# Altium schematic sheet USB_To_Ethernet.SchDoc
size A0
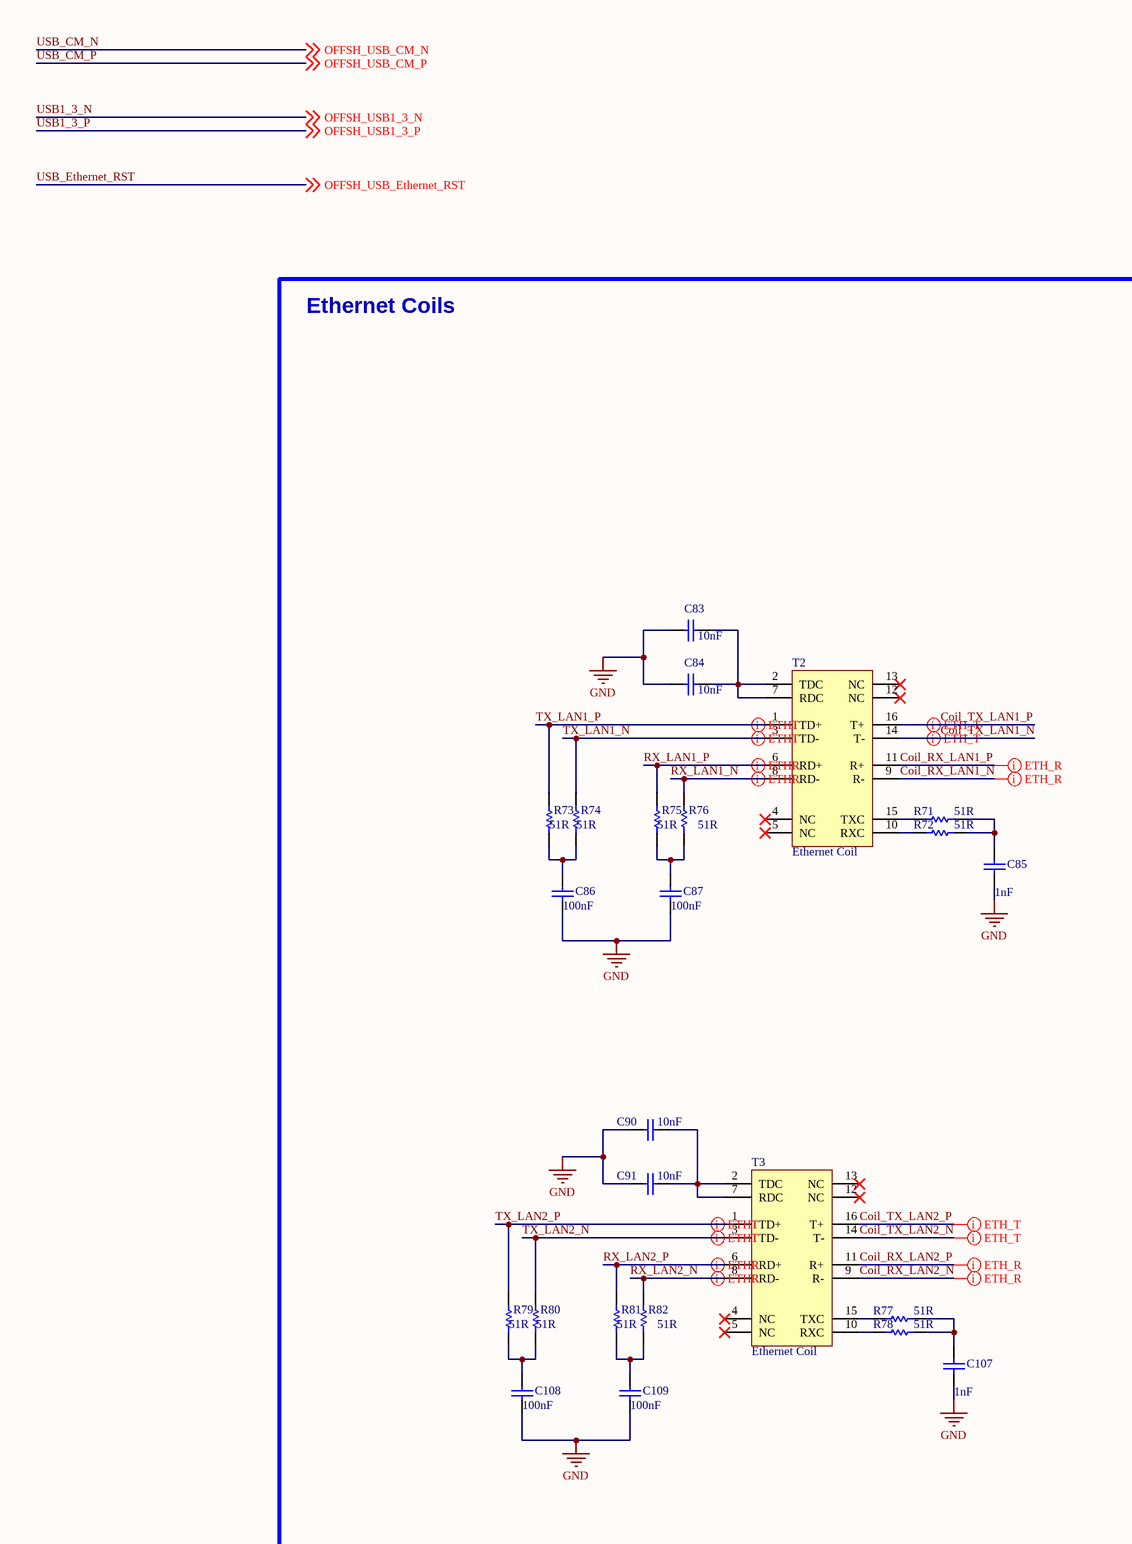
[diagram p0: USB_To_Ethernet.SchDoc, top left]
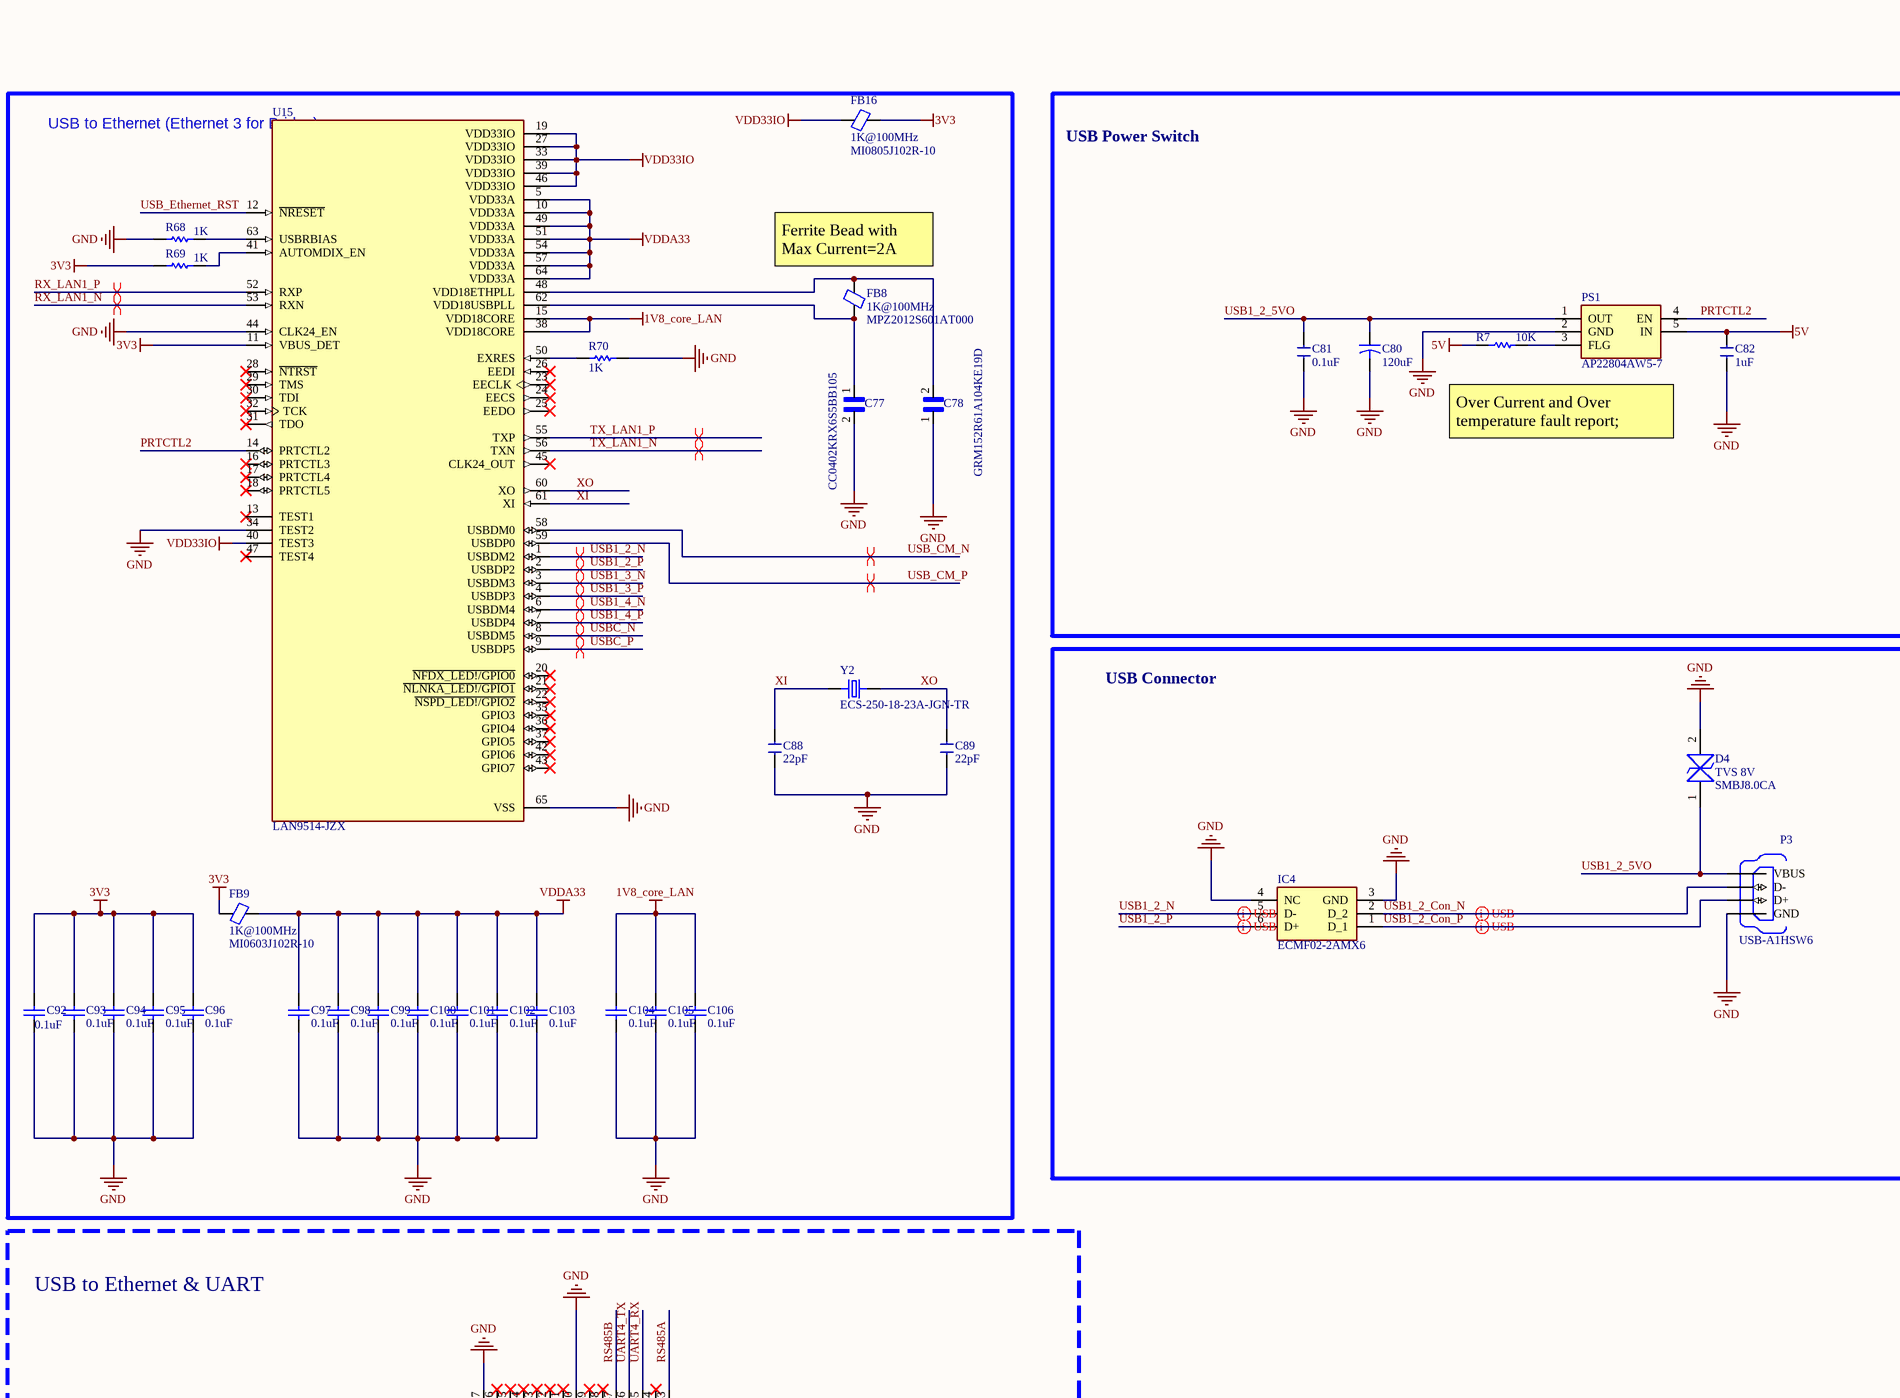
[diagram p1: USB_To_Ethernet.SchDoc, top middle]
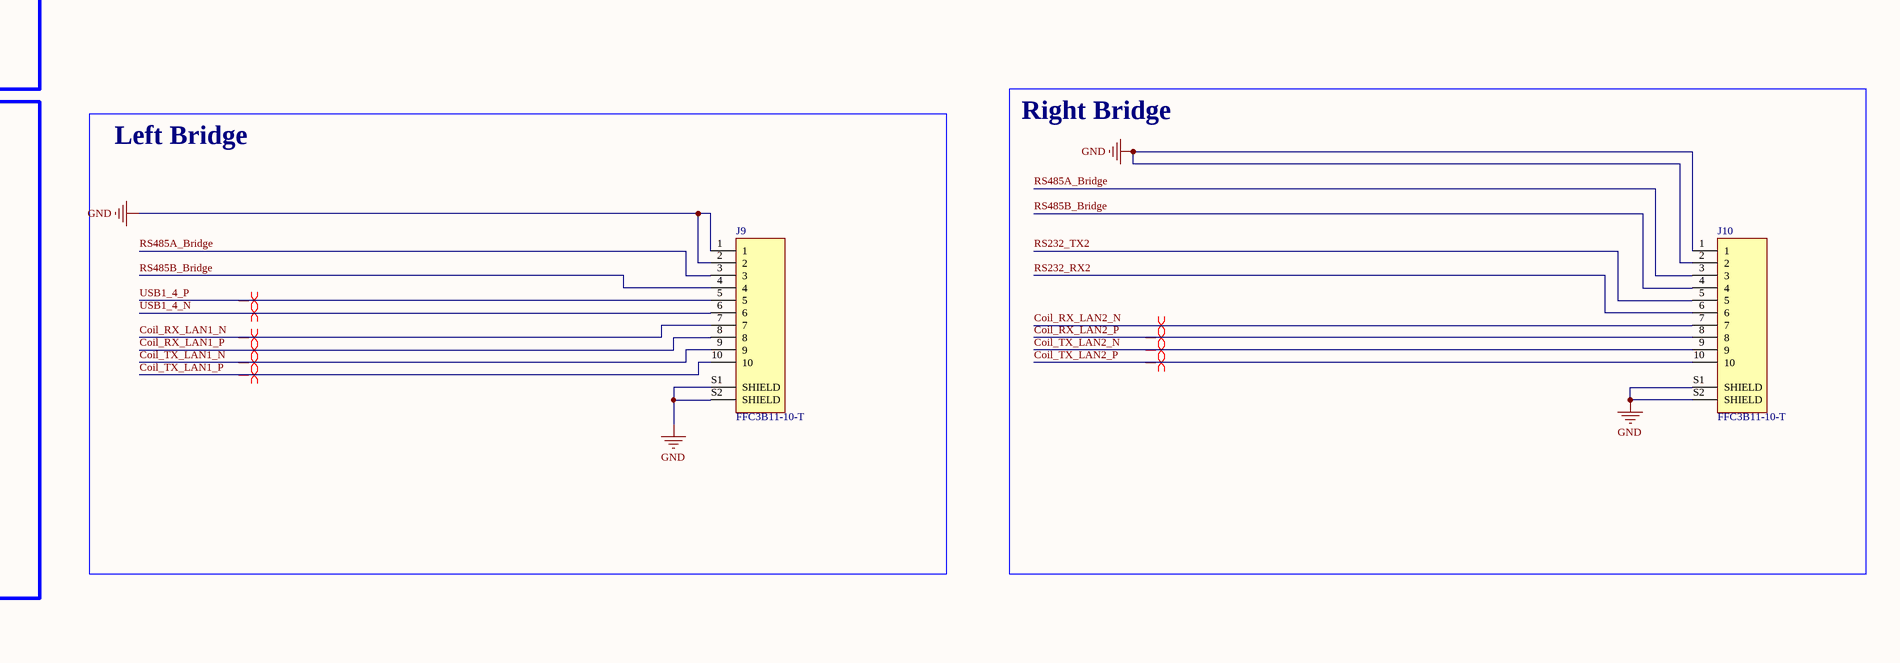
[diagram p2: USB_To_Ethernet.SchDoc, top right]
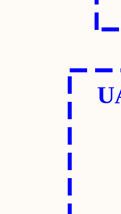
[diagram p3: USB_To_Ethernet.SchDoc, bottom left]
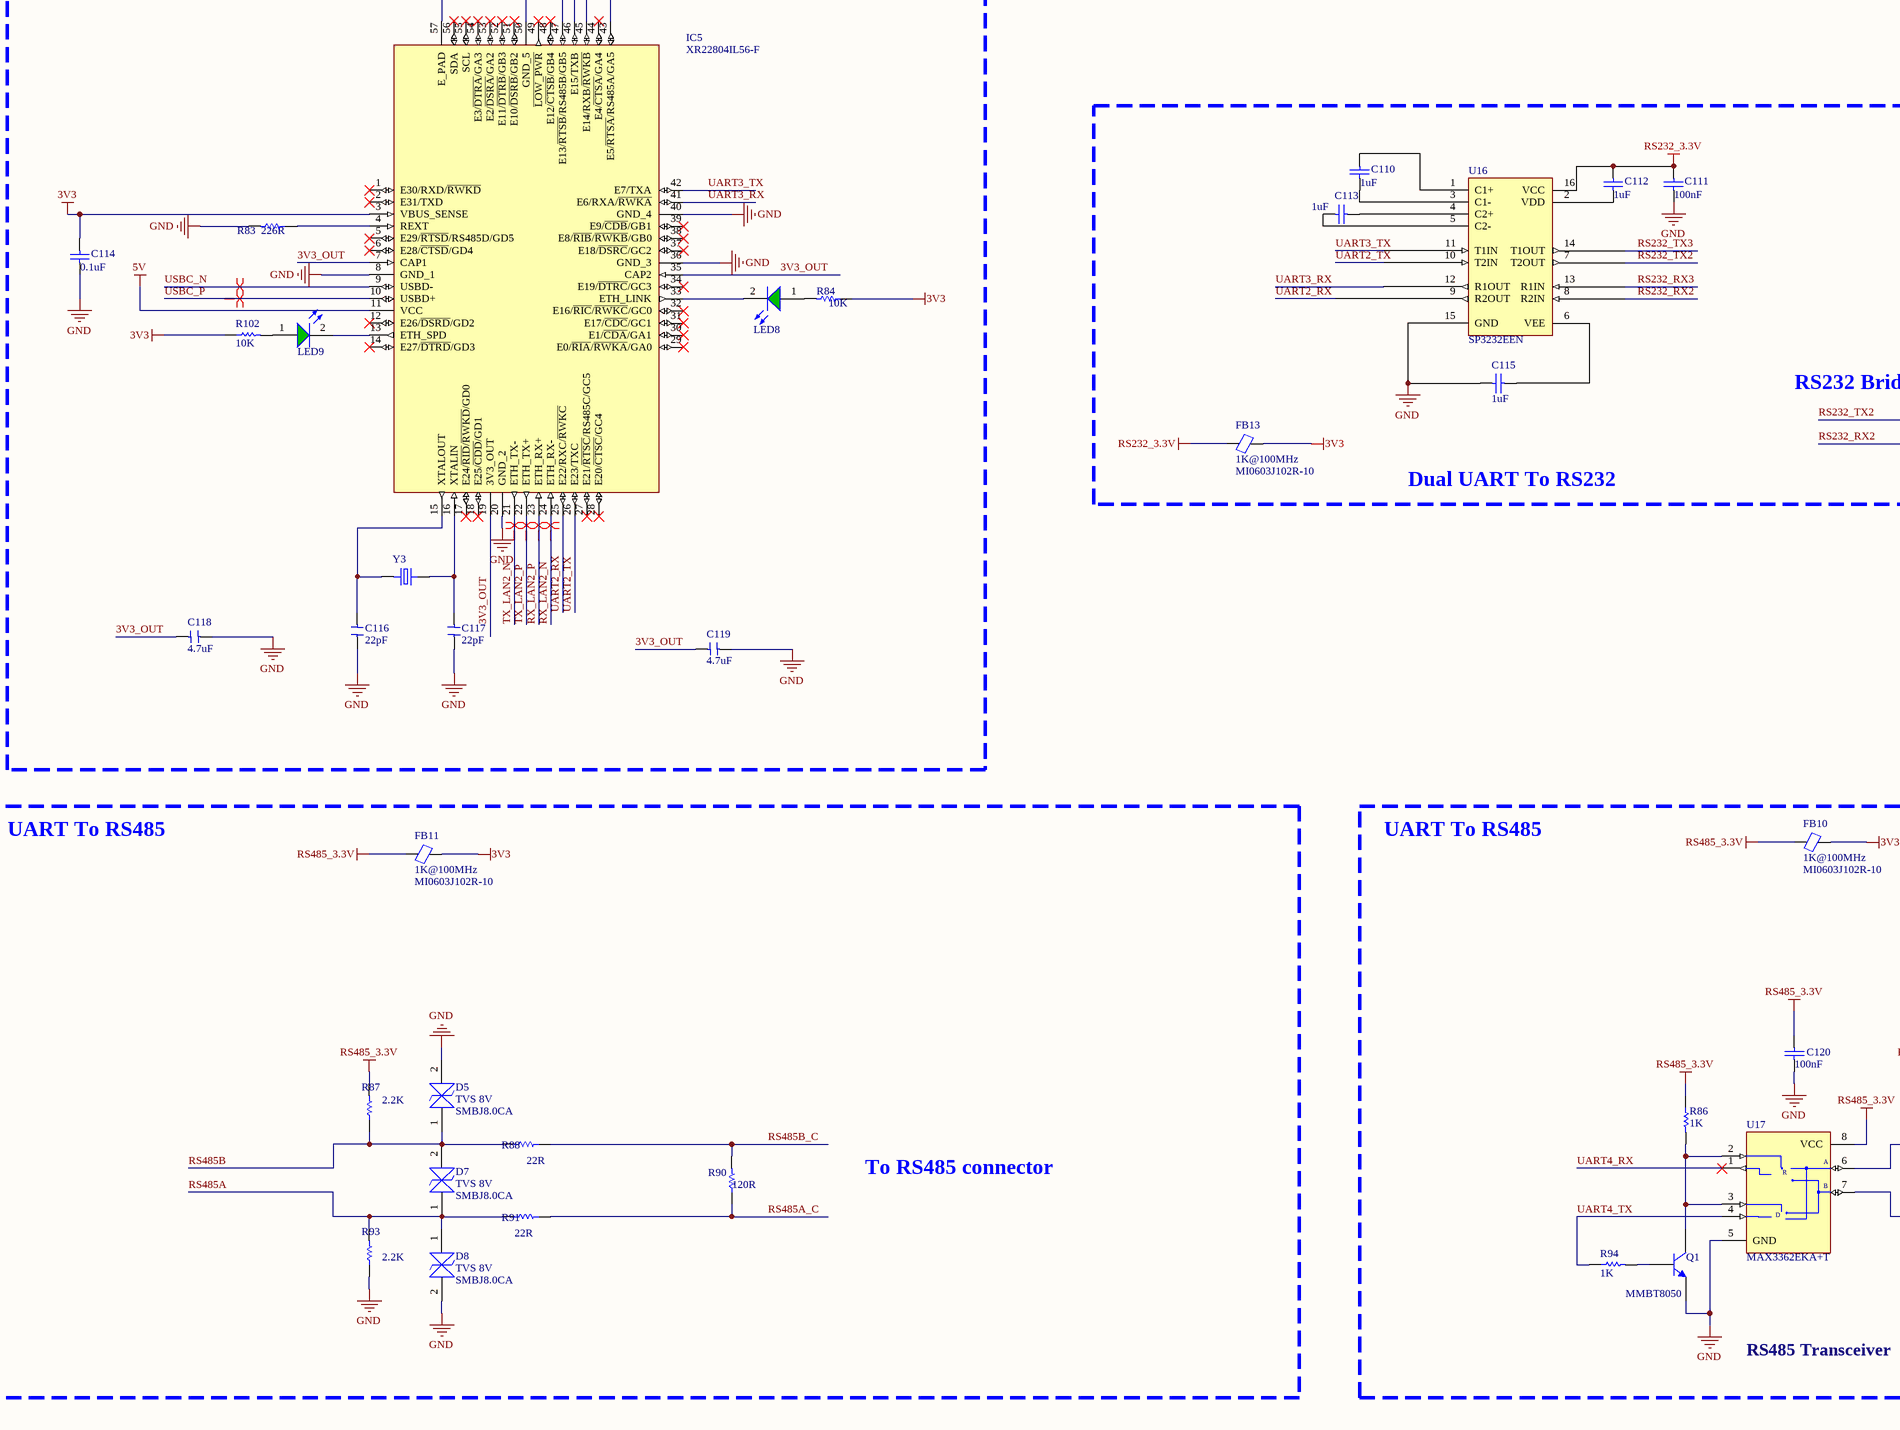
[diagram p4: USB_To_Ethernet.SchDoc, bottom middle]
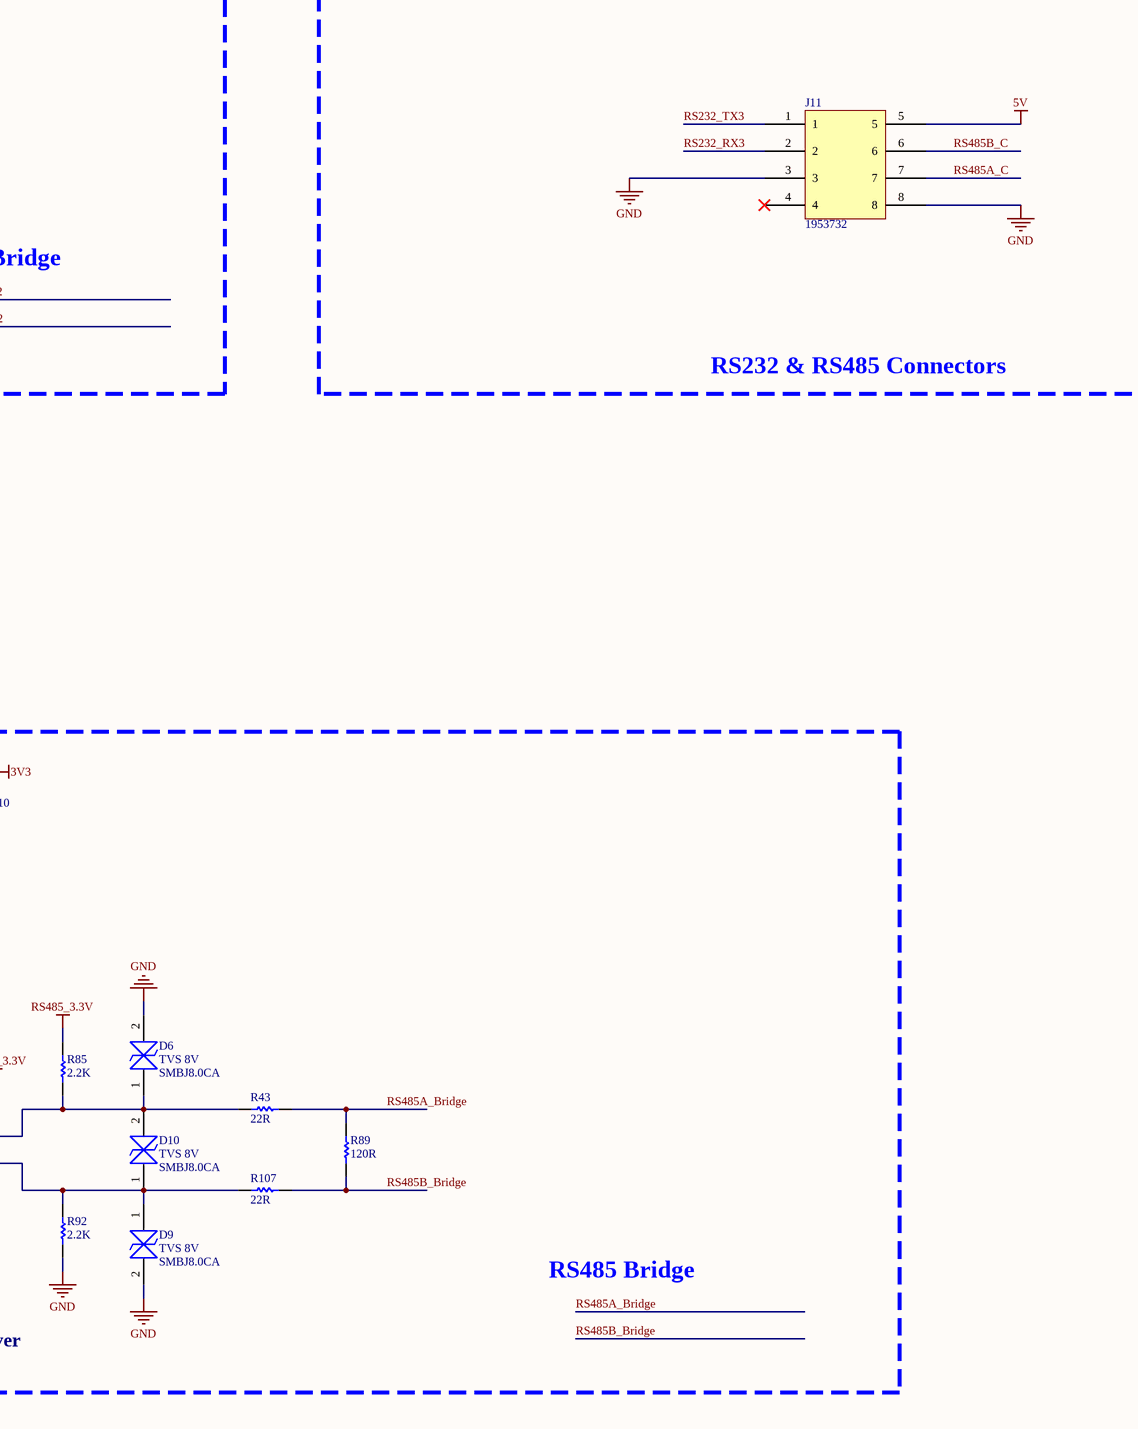
[diagram p5: USB_To_Ethernet.SchDoc, bottom right]

## Parts
C77  CC0402KRX6S5BB105  [CAPC1005X55N]
C78  GRM152R61A104KE19D  [CAPC1005X22N]
C80  value 120uF  [TANTAL (SIZE B)]  (hidden comment: Cap_Tantal)
C81  value 0.1uF  [0603 Capacitor]  (hidden comment: Capacitor SMD)
C82  value 1uF  [0603 Capacitor]  (hidden comment: Capacitor SMD)
C83  10nF  [CAP (0603)]
C84  10nF  [CAP (0603)]
C85  1nF  [CAP (0603)]
C86  100nF  [CAP (0603)]
C87  100nF  [CAP (0603)]
C88  value 22pF  [0603 Capacitor]  (hidden comment: Capacitor SMD)
C89  value 22pF  [0603 Capacitor]  (hidden comment: Capacitor SMD)
C90  10nF  [CAP (0603)]
C91  10nF  [CAP (0603)]
C92  0.1uF  [C0603]
C93  0.1uF  [C0603]
C94  0.1uF  [C0603]
C95  0.1uF  [C0603]
C96  0.1uF  [C0603]
C97  0.1uF  [C0603]
C98  0.1uF  [C0603]
C99  0.1uF  [C0603]
C100  0.1uF  [C0603]
C101  0.1uF  [C0603]
C102  0.1uF  [C0603]
C103  0.1uF  [C0603]
C104  0.1uF  [C0603]
C105  0.1uF  [C0603]
C106  0.1uF  [C0603]
C107  1nF  [CAP (0603)]
C108  100nF  [CAP (0603)]
C109  100nF  [CAP (0603)]
C110  1uF  [C0603]
C111  100nF  [C0603]
C112  1uF  [C0603]
C113  1uF  [C0603]
C114  0.1uF  [C0603]
C115  value 1uF  [C0603]
C116  value 22pF  [0603 Capacitor]  (hidden comment: Capacitor SMD)
C117  value 22pF  [0603 Capacitor]  (hidden comment: Capacitor SMD)
C118  value 4.7uF  [0603 Capacitor]  (hidden comment: Capacitor SMD)
C119  value 4.7uF  [0603 Capacitor]  (hidden comment: Capacitor SMD)
C120  value 100nF  [C1206]  (hidden comment: Cap Semi)
D4  TVS 8V  Part Number: SMBJ8.0CA  [DIOM5436X244N (SMB)]
D5  TVS 8V  Part Number: SMBJ8.0CA  [DIOM5436X244N (SMB)]
D6  TVS 8V  Part Number: SMBJ8.0CA  [DIOM5436X244N (SMB)]
D7  TVS 8V  Part Number: SMBJ8.0CA  [DIOM5436X244N (SMB)]
D8  TVS 8V  Part Number: SMBJ8.0CA  [DIOM5436X244N (SMB)]
D9  TVS 8V  Part Number: SMBJ8.0CA  [DIOM5436X244N (SMB)]
D10  TVS 8V  Part Number: SMBJ8.0CA  [DIOM5436X244N (SMB)]
FB8  value 1K@100MHz  Part Number: MPZ2012S601AT000  [FB0805]  (hidden comment: Ferrite Bead)
FB9  value 1K@100MHz  Part Number: MI0603J102R-10  [FB0603]  (hidden comment: Ferrite Bead)
FB10  value 1K@100MHz  Part Number: MI0603J102R-10  [FB0603]  (hidden comment: Ferrite Bead)
FB11  value 1K@100MHz  Part Number: MI0603J102R-10  [FB0603]  (hidden comment: Ferrite Bead)
FB13  value 1K@100MHz  Part Number: MI0603J102R-10  [FB0603]  (hidden comment: Ferrite Bead)
FB16  value 1K@100MHz  Part Number: MI0805J102R-10  [FB0805]  (hidden comment: Ferrite Bead)
IC4  ECMF02-2AMX6  [SON50P150X170X55-6N-D]
IC5  XR22804IL56-F  [QFN50P800X800X90-57N]
J9  FFC3B11-10-T  [PCBComponent_1]
J10  FFC3B11-10-T  [PCBComponent_1]
J11  1953732  [1953732]
LED8  150080GS75000  [LED_0805_Green]  (value not drawn)
LED9  150080GS75000  [LED_0805_Green]  (value not drawn)
P3  USB-A1HSW6  [OST_USB-A1HSW6]
PS1  AP22804AW5-7  [SOT95P285X140-5N]
Q1  MMBT8050  [SOT95P237X111-3N (SOT23)]
R7  value 10K  [RES (0603)]  (hidden comment: Res)
R43  value 22R  [RES (0603)]  (hidden comment: Res)
R68  value 1K  [R0603]  (hidden comment: Res)
R69  value 1K  [R0603]  (hidden comment: Res)
R70  value 1K  [R0603]  (hidden comment: Res)
R71  51R  [RES 0603]
R72  51R  [RES 0603]
R73  51R  [RES 0603]
R74  51R  [RES 0603]
R75  51R  [RES 0603]
R76  51R  [RES 0603]
R77  51R  [RES 0603]
R78  51R  [RES 0603]
R79  51R  [RES 0603]
R80  51R  [RES 0603]
R81  51R  [RES 0603]
R82  51R  [RES 0603]
R83  value 226R  [R0603]  (hidden comment: Res)
R84  value 10K  [R0603]  (hidden comment: Res)
R85  value 2.2K  [RES (0603)]  (hidden comment: Res)
R86  value 1K  [RES (0603)]  (hidden comment: Res)
R87  value 2.2K  [R0603]  (hidden comment: Res)
R88  value 22R  [R0603]  (hidden comment: Res)
R89  value 120R  [RES (0603)]  (hidden comment: Res)
R90  value 120R  [R0603]  (hidden comment: Res)
R91  value 22R  [R0603]  (hidden comment: Res)
R92  value 2.2K  [RES (0603)]  (hidden comment: Res)
R93  value 2.2K  [R0603]  (hidden comment: Res)
R94  value 1K  [RES (0603)]  (hidden comment: Res)
R102  value 10K  [RES (0603)]  (hidden comment: Res)
R107  value 22R  [RES (0603)]  (hidden comment: Res)
T2  Ethernet Coil  [SOIC127P940X597-16N (SOIC16)]
T3  Ethernet Coil  [SOIC127P940X597-16N (SOIC16)]
U15  LAN9514-JZX  [QFN50P900X900X100-65N730X730]
U16  SP3232EEN  [SOIC16_M]
U17  RS485 Transceiver  [SOT65P280X145-8N (SOT23)]  (value not drawn)
Y2  ECS-250-18-23A-JGN-TR  [XTAL_ECS-250-18-23A-JGN-TR]
Y3  ECS-250-18-23A-JGN-TR  [XTAL_ECS-250-18-23A-JGN-TR]  (value not drawn)

## Blocks framed on the sheet
USB to Ethernet (Ethernet 3 for Bridge): C77 C78 C88 C89 C92-C106 FB8 FB9 FB16 R68-R70 U15 Y2
USB Power Switch: C80-C82 PS1 R7
Ethernet Coils: C83-C87 C90 C91 C107-C109 R71-R82 T2 T3
USB Connector: D4 IC4 P3
Left Bridge: J9
Right Bridge: J10

## Nets
1V8_core_LAN: C104.2 C105.2 C106.2 U15.15(VDD18CORE) U15.38(VDD18CORE)
3V3: C92.2 C93.2 C94.2 C95.2 C96.2 C114.2 FB9.1 FB10.2 FB11.2 FB13.2 FB16.2 IC5.3(VBUS_SENSE) R69.2 R84.1 R102.1 U15.11(VBUS_DET)
5V: C82.1 IC5.11(VCC) J11.5 PS1.5(IN) R7.1
GND: C77.2 C78.1 C80.2 C81.2 C82.2 C83.1 C84.1 C85.1 C86.1 C87.1 C88.2 C89.2 C90.1 C91.1 C92.1 C93.1 C94.1 C95.1 C96.1 C97.1 C98.1 C99.1 C100.1 C101.1 C102.1 C103.1 C104.1 C105.1 C106.1 C107.1 C108.1 C109.1 C111.1 C114.1 C115.2 C116.2 C117.2 C118.2 C119.2 C120.2 D4.2(A) D5.2(A) D6.2(A) D8.2(A) D9.2(A) IC4.3(GND) IC4.4(NC) IC5.8(GND_1) IC5.20(GND_2) IC5.36(GND_3) IC5.40(GND_4) IC5.50(GND_5) IC5.57(E_PAD) J9.1 J9.2 J9.S1(SHIELD) J9.S2(SHIELD) J10.1 J10.2 J10.S1(SHIELD) J10.S2(SHIELD) J11.3 J11.8 P3.4(GND) PS1.2(GND) Q1.2(E) R68.2 R70.1 R83.2 R92.2 R93.1 U15.34(TEST2) U15.44(CLK24_EN) U15.65(VSS) U16.15(GND) U17.5(GND)
RS232_3.3V: C111.2 C112.2 FB13.1 U16.16(VCC)
RS485_3.3V: C120.1 FB10.1 FB11.1 R85.1 R86.1 R87.2 U17.8(VCC)
VDD33IO: FB16.1 U15.19(VDD33IO) U15.27(VDD33IO) U15.33(VDD33IO) U15.39(VDD33IO) U15.40(TEST3) U15.46(VDD33IO)
VDDA33: C97.2 C98.2 C99.2 C100.2 C101.2 C102.2 C103.2 FB9.2 U15.5(VDD33A) U15.10(VDD33A) U15.49(VDD33A) U15.51(VDD33A) U15.54(VDD33A) U15.57(VDD33A) U15.64(VDD33A)
3V3_OUT: C118.1 C119.1 IC5.7(CAP1) IC5.19(3V3_OUT) IC5.35(CAP2)
Coil_RX_LAN1_N: J9.7 T2.9(R-)
Coil_RX_LAN1_P: J9.8 T2.11(R+)
Coil_RX_LAN2_N: J10.7 T3.9(R-)
Coil_RX_LAN2_P: J10.8 T3.11(R+)
Coil_TX_LAN1_N: J9.9 T2.14(T-)
Coil_TX_LAN1_P: J9.10 T2.16(T+)
Coil_TX_LAN2_N: J10.9 T3.14(T-)
Coil_TX_LAN2_P: J10.10 T3.16(T+)
PRTCTL2: PS1.4(EN) U15.14(PRTCTL2)
RS232_RX2: J10.6 U16.8(R2IN)
RS232_RX3: J11.2 U16.13(R1IN)
RS232_TX2: J10.5 U16.7(T2OUT)
RS232_TX3: J11.1 U16.14(T1OUT)
RS485A: D7.1(K) D8.1(K) IC5.43(E5/~{RTSA}/RS485A/GA5) R91.2 R93.2
RS485A_Bridge: J9.3 J10.3 R43.2 R89.1
RS485A_C: J11.7 R90.1 R91.1
RS485B: D5.1(K) D7.2(A) IC5.47(E13/~{RTSB}/RS485B/GB5) R87.1 R88.2
RS485B_Bridge: J9.4 J10.4 R89.2 R107.2
RS485B_C: J11.6 R88.1 R90.2
RX_LAN1_N: R76.2 T2.8(RD-) U15.53(RXN)
RX_LAN1_P: R75.2 T2.6(RD+) U15.52(RXP)
RX_LAN2_N: IC5.24(ETH_RX-) R82.2 T3.8(RD-)
RX_LAN2_P: IC5.23(ETH_RX+) R81.2 T3.6(RD+)
TX_LAN1_N: R74.2 T2.3(TD-) U15.56(TXN)
TX_LAN1_P: R73.2 T2.1(TD+) U15.55(TXP)
TX_LAN2_N: IC5.21(ETH_TX-) R80.2 T3.3(TD-)
TX_LAN2_P: IC5.22(ETH_TX+) R79.2 T3.1(TD+)
UART2_RX: IC5.25(E22/RXC/~{RWKC}) U16.9(R2OUT)
UART2_TX: IC5.26(E23/TXC) U16.10(T2IN)
UART3_RX: IC5.41(E6/RXA/~{RWKA}) U16.12(R1OUT)
UART3_TX: IC5.42(E7/TXA) U16.11(T1IN)
UART4_RX: IC5.45(E14/RXB/~{RWKB}) U17.1(RO)
UART4_TX: IC5.46(E15/TXB) R94.1 U17.4(DI)
USB1_2_5VO: C80.1 C81.1 D4.1(K) P3.1(VBUS) PS1.1(OUT)
USB1_2_Con_N: IC4.2(D_2) P3.2(D-)
USB1_2_Con_P: IC4.1(D_1) P3.3(D+)
USB1_2_N: IC4.5(D-) U15.1(USBDM2)
USB1_2_P: IC4.6(D+) U15.2(USBDP2)
USB1_3_N: U15.3(USBDM3) ; off-sheet OFFSH_USB1_3_N  [also labelled OFFSH_USB1_3_N]
USB1_3_P: U15.4(USBDP3) ; off-sheet OFFSH_USB1_3_P  [also labelled OFFSH_USB1_3_P]
USB1_4_N: J9.6 U15.6(USBDM4)
USB1_4_P: J9.5 U15.7(USBDP4)
USB_CM_N: U15.58(USBDM0) ; off-sheet OFFSH_USB_CM_N  [also labelled OFFSH_USB_CM_N]
USB_CM_P: U15.59(USBDP0) ; off-sheet OFFSH_USB_CM_P  [also labelled OFFSH_USB_CM_P]
USB_Ethernet_RST: U15.12(~{NRESET}) ; off-sheet OFFSH_USB_Ethernet_RST  [also labelled OFFSH_USB_Ethernet_RST]
USBC_N: IC5.9(USBD-) U15.8(USBDM5)
USBC_P: IC5.10(USBD+) U15.9(USBDP5)
XI: C88.1 U15.61(XI) Y2.1(IN/OUT)
XO: C89.1 U15.60(XO) Y2.2(OUT/IN)
NetC77_1: C77.1 FB8.1 U15.62(VDD18USBPLL)
NetC78_2: C78.2 FB8.2 U15.48(VDD18ETHPLL)
NetC83_2: C83.2 C84.2 T2.2(TDC) T2.7(RDC)
NetC85_2: C85.2 R71.1 R72.1
NetC86_2: C86.2 R73.1 R74.1
NetC87_2: C87.2 R75.1 R76.1
NetC90_2: C90.2 C91.2 T3.2(TDC) T3.7(RDC)
NetC107_2: C107.2 R77.1 R78.1
NetC108_2: C108.2 R79.1 R80.1
NetC109_2: C109.2 R81.1 R82.1
NetC110_1: C110.1 U16.3(C1-)
NetC110_2: C110.2 U16.1(C1+)
NetC112_1: C112.1 U16.2(VDD)
NetC113_1: C113.1 U16.4(C2+)
NetC113_2: C113.2 U16.5(C2-)
NetC115_1: C115.1 U16.6(VEE)
NetC116_1: C116.1 IC5.15(XTALOUT) Y3.1(IN/OUT)
NetC117_1: C117.1 IC5.16(XTALIN) Y3.2(OUT/IN)
NetD6_1: D6.1(K) D10.2(A) R43.1 R85.2 U17.6(A)
NetD9_1: D9.1(K) D10.1(K) R92.1 R107.1 U17.7(B)
NetIC5_4: IC5.4(REXT) R83.1
NetIC5_13: IC5.13(ETH_SPD) LED9.2(C)
NetIC5_33: IC5.33(ETH_LINK) LED8.2(C)
NetLED8_1: LED8.1(A) R84.2
NetLED9_1: LED9.1(A) R102.2
NetPS1_3: PS1.3(FLG) R7.2
NetQ1_1: Q1.1(B) R94.2
NetQ1_3: Q1.3(C) R86.2 U17.2(~{RE}) U17.3(DE)
NetR68_1: R68.1 U15.63(USBRBIAS)
NetR69_1: R69.1 U15.41(AUTOMDIX_EN)
NetR70_2: R70.2 U15.50(EXRES)
NetR71_2: R71.2 T2.15(TXC)
NetR72_2: R72.2 T2.10(RXC)
NetR77_2: R77.2 T3.15(TXC)
NetR78_2: R78.2 T3.10(RXC)

Not connected (* = marked no-connect by the designer): IC5 1(E30/RXD/~{RWKD})* 2(E31/TXD)* 5(E29/~{RTSD}/RS485D/GD5)* 6(E28/~{CTSD}/GD4)* 12(E26/~{DSRD}/GD2)* 14(E27/~{DTRD}/GD3)* 17(E24/~{RID}/~{RWKD}/GD0)* 18(E25/~{CDD}/GD1)* 27(E21/~{RTSC}/RS485C/GC5)* 28(E20/~{CTSC}/GC4)* 29(E0/~{RIA}/~{RWKA}/GA0)* 30(E1/~{CDA}/GA1)* 31(E17/~{CDC}/GC1)* 32(E16/~{RIC}/~{RWKC}/GC0)* 34(E19/~{DTRC}/GC3)* 37(E18/~{DSRC}/GC2)* 38(E8/~{RIB}/~{RWKB}/GB0)* 39(E9/~{CDB}/GB1)* 44(E4/~{CTSA}/GA4)* 48(E12/~{CTSB}/GB4)* 49(~{LOW_PWR})* 51(E10/~{DSRB}/GB2)* 52(E11/~{DTRB}/GB3)* 53(E2/~{DSRA}/GA2)* 54(E3/~{DTRA}/GA3)* 55(SCL)* 56(SDA)*; J11 4*; T2 4(NC)* 5(NC)* 12(NC)* 13(NC)*; T3 4(NC)* 5(NC)* 12(NC)* 13(NC)*; U15 13(TEST1)* 16(PRTCTL3)* 17(PRTCTL4)* 18(PRTCTL5)* 20(~{NFDX_LED!/GPIO0})* 21(~{NLNKA_LED!/GPIO1})* 22(~{NSPD_LED!/GPIO2})* 23(EECLK)* 24(EECS)* 25(EEDO)* 26(EEDI)* 28(~{NTRST})* 29(TMS)* 30(TDI)* 31(TDO)* 32(TCK)* 35(GPIO3)* 36(GPIO4)* 37(GPIO5)* 42(GPIO6)* 43(GPIO7)* 45(CLK24_OUT)* 47(TEST4)*

## Layout directives
differential pair: Coil_RX_LAN1_N, Coil_RX_LAN1_P, Coil_RX_LAN2_N, Coil_RX_LAN2_P, Coil_TX_LAN1_N, Coil_TX_LAN1_P, Coil_TX_LAN2_N, Coil_TX_LAN2_P, RX_LAN1_N, RX_LAN1_P, RX_LAN2_N, RX_LAN2_P, TX_LAN1_N, TX_LAN1_P, TX_LAN2_N, TX_LAN2_P, USB1_2_N, USB1_2_P, USB1_3_N, USB1_3_P, USB1_4_N, USB1_4_P, USB_CM_N, USB_CM_P, USBC_N, USBC_P
differential pair; differential pair class ETH; net class ETHT: TX_LAN1_N, TX_LAN1_P, TX_LAN2_N, TX_LAN2_P
differential pair; differential pair class ETH; net class ETHR: RX_LAN1_P, RX_LAN2_P
differential pair; differential pair class ETH: RX_LAN1_N, RX_LAN2_N
differential pair; differential pair class ETH; net class ETH_T: Coil_TX_LAN1_N, Coil_TX_LAN1_P, Coil_TX_LAN2_N, Coil_TX_LAN2_P
differential pair; differential pair class ETH; net class ETH_R: Coil_RX_LAN1_N, Coil_RX_LAN1_P, Coil_RX_LAN2_N, Coil_RX_LAN2_P
differential pair; net class USB: USB1_2_Con_N, USB1_2_Con_P, USB1_2_N, USB1_2_P

## Notes on the sheet
- (near FB8) Ferrite Bead with Max Current=2A
- Over Current and Over temperature fault report;
- USB to Ethernet & UART
- RS232 Bridge
- Dual UART To RS232
- RS232 & RS485 Connectors
- UART To RS485
- To RS485 connector
- RS485 Bridge
- RS485 Transceiver
- (in symbol MAX3362EKA+T) R; D

## Library data of the parts
C77 = CC0402KRX6S5BB105: CAP CER 1UF 6.3V X6S 0402; Package: None; Price: None; Value: *; MP: CC0402KRX6S5BB105; Availability: Unavailable
C78 = GRM152R61A104KE19D: CAP CER 0.1UF 10V X5R 0402; Package: None; Price: None; Value: *; MP: GRM152R61A104KE19D; Availability: Unavailable
C80 = Cap_Tantal: Tantalum Capacitor; Voltage: 10V
C81 C82 C88 C89 C116-C119 = Capacitor SMD: Voltage: 50v
C83-C87 C90 C91 C107-C109 = Cap: SMD capacitor
  C83 C84 C90 C91: Value: 10nF
  C85 C107: Value: 1nF
  C86 C87 C108 C109: Value: 100nF
C92-C106 C110-C114 = Cap Semi: Capacitor (Semiconductor SIM Model); Value: 2.2nf; Published: 8-Jun-2000; LatestRevisionDate: 17-Jul-2002; LatestRevisionNote: Re-released for DXP Platform.; PackageReference: C1206; Publisher: Altium Limited
C115 C120 = Cap Semi: Capacitor (Semiconductor SIM Model); Published: 8-Jun-2000; LatestRevisionDate: 29-May-2009; LatestRevisionNote: IPC-7351 Footprint Added.; PackageReference: C1206; Publisher: Altium Limited; PackageDescription: Chip Capacitor
D4 D5 D8 = SMBJ6.0CA: Bidirectional TVS 8V SMB; Manufacturer_Name: Littelfuse; Datasheet Link: https://www.littelfuse.com/~/media/electronics/datasheets/tvs_diodes/littelfuse_tvs_diode_smbj_datasheet.pdf.pdf; Height: 2.44mm; Link: https://www.digikey.sg/product-detail/en/littelfuse-inc/SMBJ6.0CA/SMBJ6.0CALFCT-ND/286102
D6 D7 D9 D10 = SMBJ6.0CA: Bidirectional TVS 6V SMB; Manufacturer_Name: Littelfuse; Datasheet Link: https://www.littelfuse.com/~/media/electronics/datasheets/tvs_diodes/littelfuse_tvs_diode_smbj_datasheet.pdf.pdf; Height: 2.44mm; Link: https://www.digikey.sg/product-detail/en/littelfuse-inc/SMBJ6.0CA/SMBJ6.0CALFCT-ND/286102
FB8-FB11 FB13 FB16 = Ferrite Bead: Ferrite Bead SMD; Link: https://www.digikey.com/product-detail/en/laird-signal-integrity-products/MI0805J102R-10/240-2551-1-ND/1015989
IC4 = ECMF02-2AMX6: Integrated Circuit; Manufacturer_Name: STMicroelectronics; Datasheet Link: http://www.st.com/content/ccc/resource/technical/document/datasheet/3a/28/cf/d0/31/63/48/8c/CD00282307.pdf/files/CD00282307.pdf/jcr:content/translations/en.CD00282307.pdf; Height: 0.55mm; Part Number: ECMF02-2AMX6; Mouser Part Number: 511-ECMF02-2AMX6; Mouser Price/Stock: https://www.mouser.com/Search/Refine.aspx?Keyword=511-ECMF02-2AMX6; RS Part Number: 8805276P; RS Price/Stock: http://uk.rs-online.com/web/p/products/8805276P
IC5 = XR22804IL56-F: Integrated Circuit; Manufacturer_Name: EXAR; Datasheet Link: https://www.exar.com/ds/xr22804_1b_04152015.pdf; Height: 1mm; Manufacturer_Part_Number: XR22804IL56-F; Mouser Part Number: 701-22804IL56-F; Mouser Price/Stock: https://www.mouser.com/Search/Refine.aspx?Keyword=701-22804IL56-F; Arrow Part Number: XR22804IL56-F; Arrow Price/Stock: https://www.arrow.com/en/products/xr22804il56-f/exar
J9 J10 = FFC3B11-10-T: 10 Position FFC, FPC Connector Contacts, Top 0.039 _1.00mm_ Surface Mount, Right Angle; MF: Global Connector Technology; Value: *; Availability: Unavailable; Price: None; SnapEDA_Link: https://www.snapeda.com/parts/FFC3B11-10-T/Global%20Connector%20Technology/view-part/4223050/?ref=snap; Package: Package Analog Devices; MP: FFC3B11-10-T
J11 = P?: Part Number: 1953732
LED8 = WL-SMCW 0805  150080GS75000: SMD mono-color Chip LED, WL-SMCW, Yellow; Manufacturer: W黵th Elektronik eiSos GmbH; Color: Green; PartNo: 150080GS75000; ComponentLink1Description: Manufacturer; ComponentLink1URL: http://www.we-online.de; Created by: Christin Otto; Created Date: June 2013; ComponentLink2Description: Datasheet; ComponentLink2URL: http://katalog.we-online.com/led/datasheet/150080GS75000.pdf
LED9 = WL-SMCW 0805  150080GS75000: SMD mono-color Chip LED, WL-SMCW, Green; Manufacturer: W黵th Elektronik eiSos GmbH; PartNo: 150080GS75000; ComponentLink1Description: Manufacturer; ComponentLink1URL: http://www.we-online.de; Created by: Christin Otto; Created Date: June 2013; ComponentLink2Description: Datasheet; ComponentLink2URL: http://katalog.we-online.com/led/datasheet/150080GS75000.pdf; Color: Green
P3 = USB-A1HSW6: USB-A _USB TYPE-A_  Receptacle Connector 4 Position Through Hole, Right Angle; MF: On Shore; SnapEDA_Link: https://www.snapeda.com/parts/USB-A1HSW6/On%20Shore%20Technology%20Inc./view-part/13110/?ref=snap; Package: None; MP: USB-A1HSW6; Availability: Unavailable; Price: None; Value: *
PS1 = AP22804AW5-7: Power Supply; Manufacturer_Name: Diodes Inc.; Datasheet Link: https://componentsearchengine.com/Datasheets/2/AP22804AW5-7.pdf; Height: 1.4mm; Manufacturer_Part_Number: AP22804AW5-7; Mouser Part Number: 621-AP22804AW5-7; Mouser Price/Stock: https://www.mouser.co.uk/ProductDetail/Diodes-Incorporated/AP22804AW5-7?qs=lqAf%2FiVYw9hgcUuNhFapmA%3D%3D; Arrow Part Number: AP22804AW5-7; Arrow Price/Stock: https://www.arrow.com/en/products/ap22804aw5-7/diodes-incorporated
Q1 = MMBT8050: NPN General Purpose Amplifier; Link: https://www.alibaba.com/product-detail/100-MMBT8050-SOT-23-J3Y-S8050_60584077590.html; Part Number: MMBT8050
R7 R43 R71-R82 R85 R86 R89 R92 R94 R102 R107 = Res: SMD resistor; Tolerance: 5%
  R71 R72 R77 R78: Value: 51R
  R73-R76 R79-R82: Value: 51r
R68-R70 R83 R84 R87 R88 R90 R91 R93 = Res: Resistor; Published: 8-Jun-2000; LatestRevisionDate: 17-Jul-2002; LatestRevisionNote: Re-released for DXP Platform.; PackageReference: AXIAL-0.3; Publisher: Altium Limited
T2 T3 = H1102NL: Ethernet Transformer; Manufacturer_Name: Pulse; Datasheet Link: https://productfinder.pulseeng.com/products/datasheets/h1102nl.pdf; Height: 5.97mm; Part Number: H1102NL
U15 = LAN9514-JZX: Ethernet Bridge, USB to Ethernet USB 2.0, 10/100 Base-T/TX PHY USB Interface 64-QFN _9x9_; MF: Microchip; MP: LAN9514-JZX; Availability: Unavailable; SnapEDA_Link: https://www.snapeda.com/parts/LAN9514-JZX/Microchip/view-part/105106/?ref=snap; Package: QFN-64 Microchip; Value: *; Price: None
U16 = MAX232CSE: IC TXRX RS232 ESD TRUE 16SOIC; Published: 16-Jan-2001; LatestRevisionDate: 13-Apr-2006; LatestRevisionNote: IPC-7351 Footprint Added.; PackageReference: NSO16; Publisher: Altium Limited; PackageDescription: 16-Pin Small Outline Integrated Circuit 1.27 mm Pitch; Code_JEDEC: MS-012-AC; Code_IPC: SOIC127P600-16; ComponentLink1Description: Manufacturer Link; ComponentLink1URL: http://www.maxim-ic.com/; ComponentLink2Description: Datasheet; ComponentLink2URL: http://pdfserv.maxim-ic.com/en/ds/MAX220-MAX249.pdf
U17 = MAX3362EKA+T: Manufacturer_Name: Maxim Integrated; Datasheet Link: http://docs-emea.rs-online.com/webdocs/0f71/0900766b80f71b05.pdf; Height: 1.45mm; Link: https://www.digikey.sg/product-detail/en/maxim-integrated/MAX3362EKA-T/MAX3362EKA-TCT-ND/9681401; Part Number: MAX3362EKA+T
Y2 Y3 = ECS-250-18-23A-JGN-TR: Crystal 2-SMD, No Lead; Package: None; Price: None; Value: *; MP: ECS-250-18-23A-JGN-TR; Availability: Unavailable